# Altium schematic sheet Telephone.SchDoc (part 1 of 3)
size A1; SheetNumber: 5; SheetTotal: 11
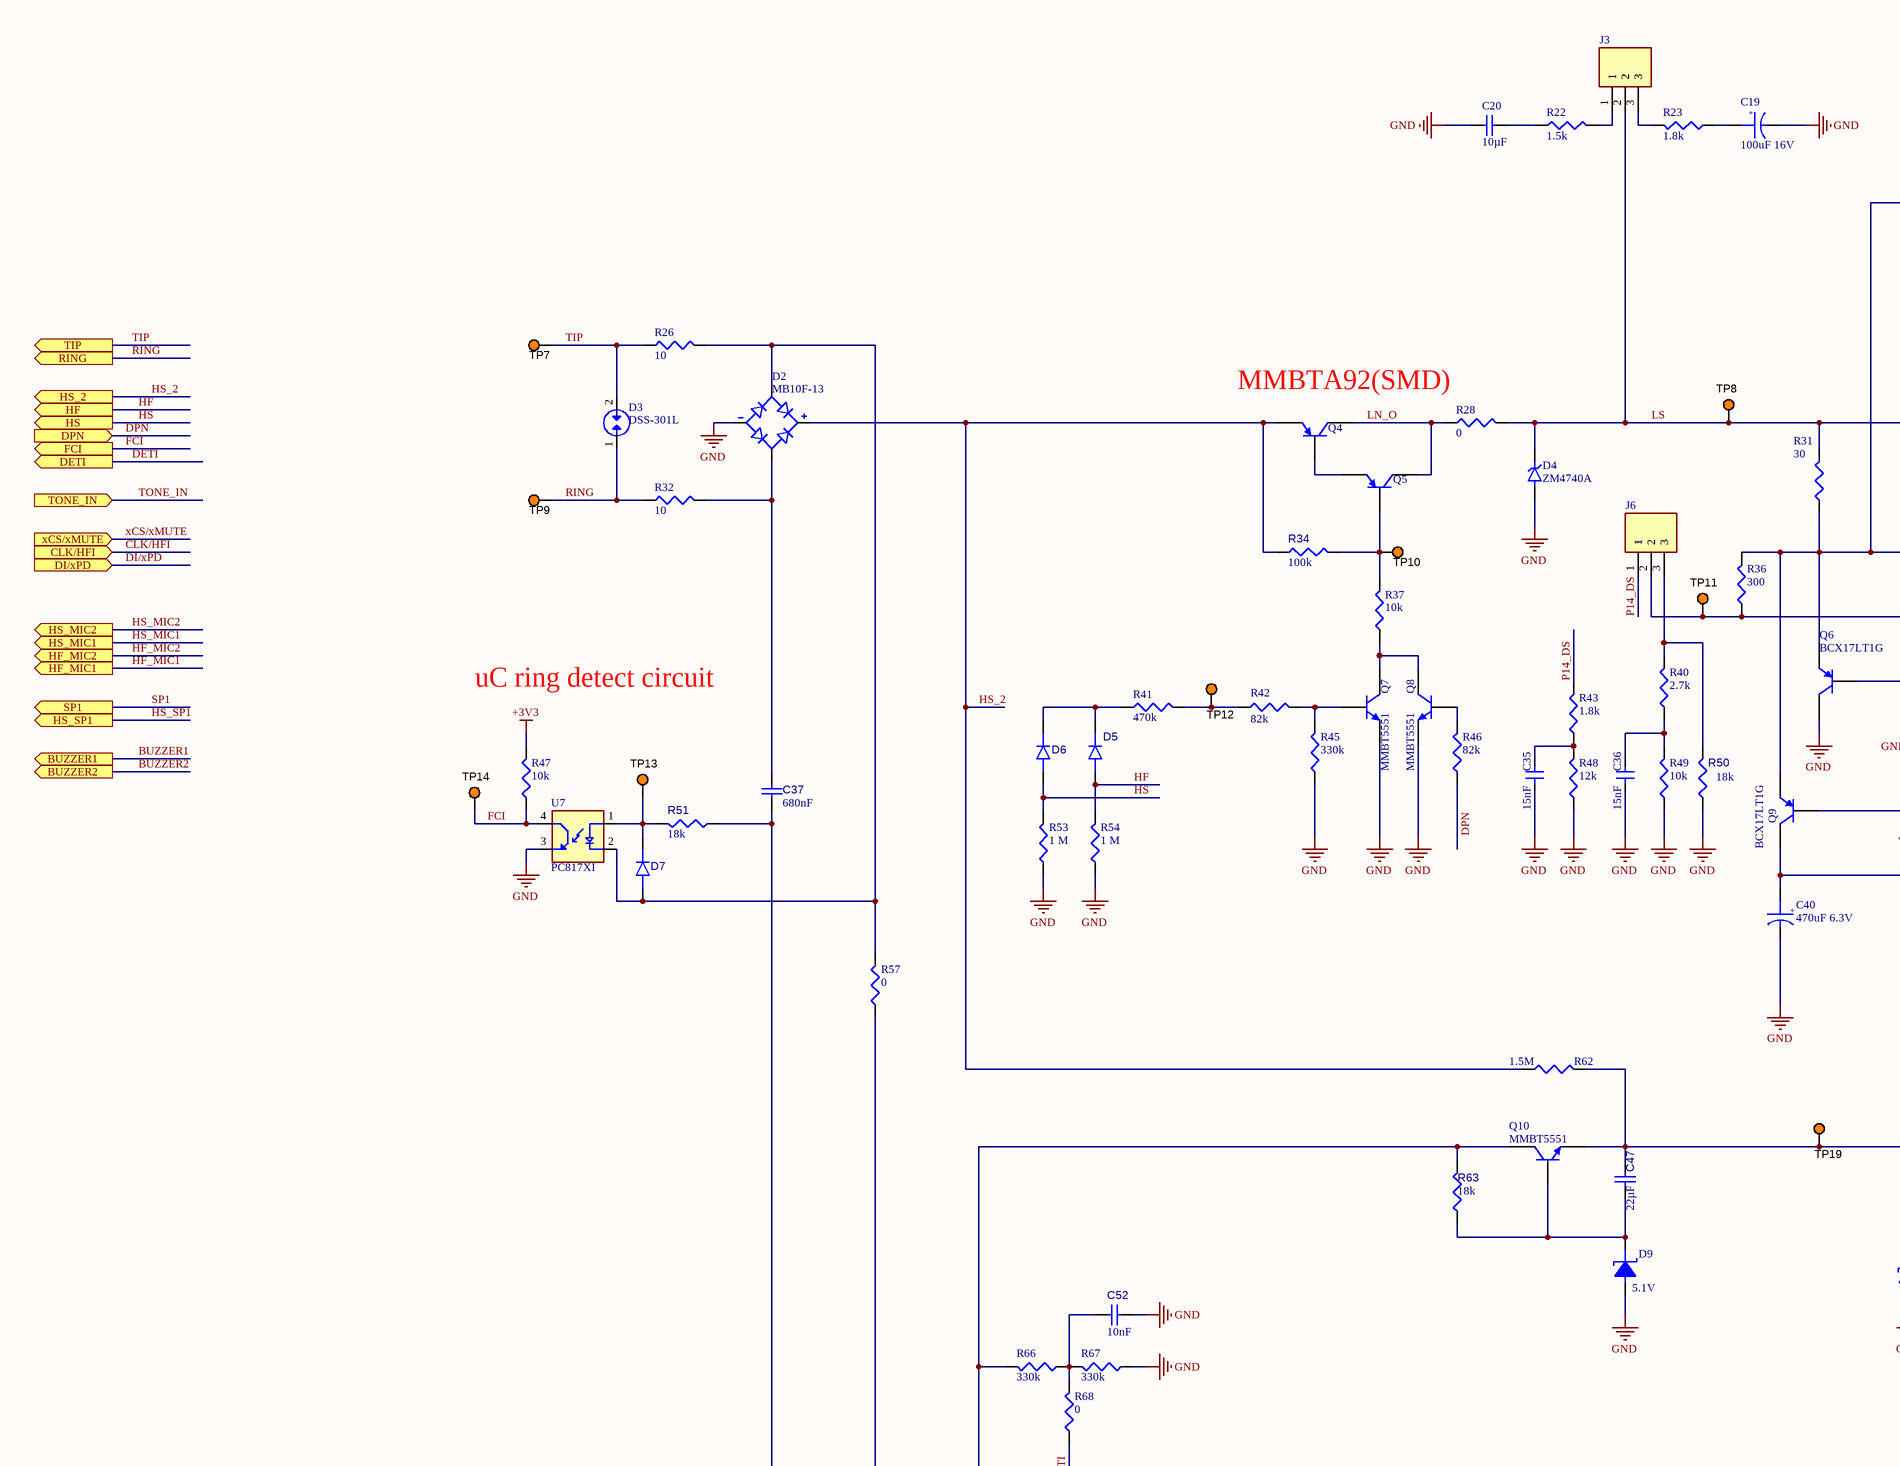
[diagram p0: Telephone.SchDoc, top left]
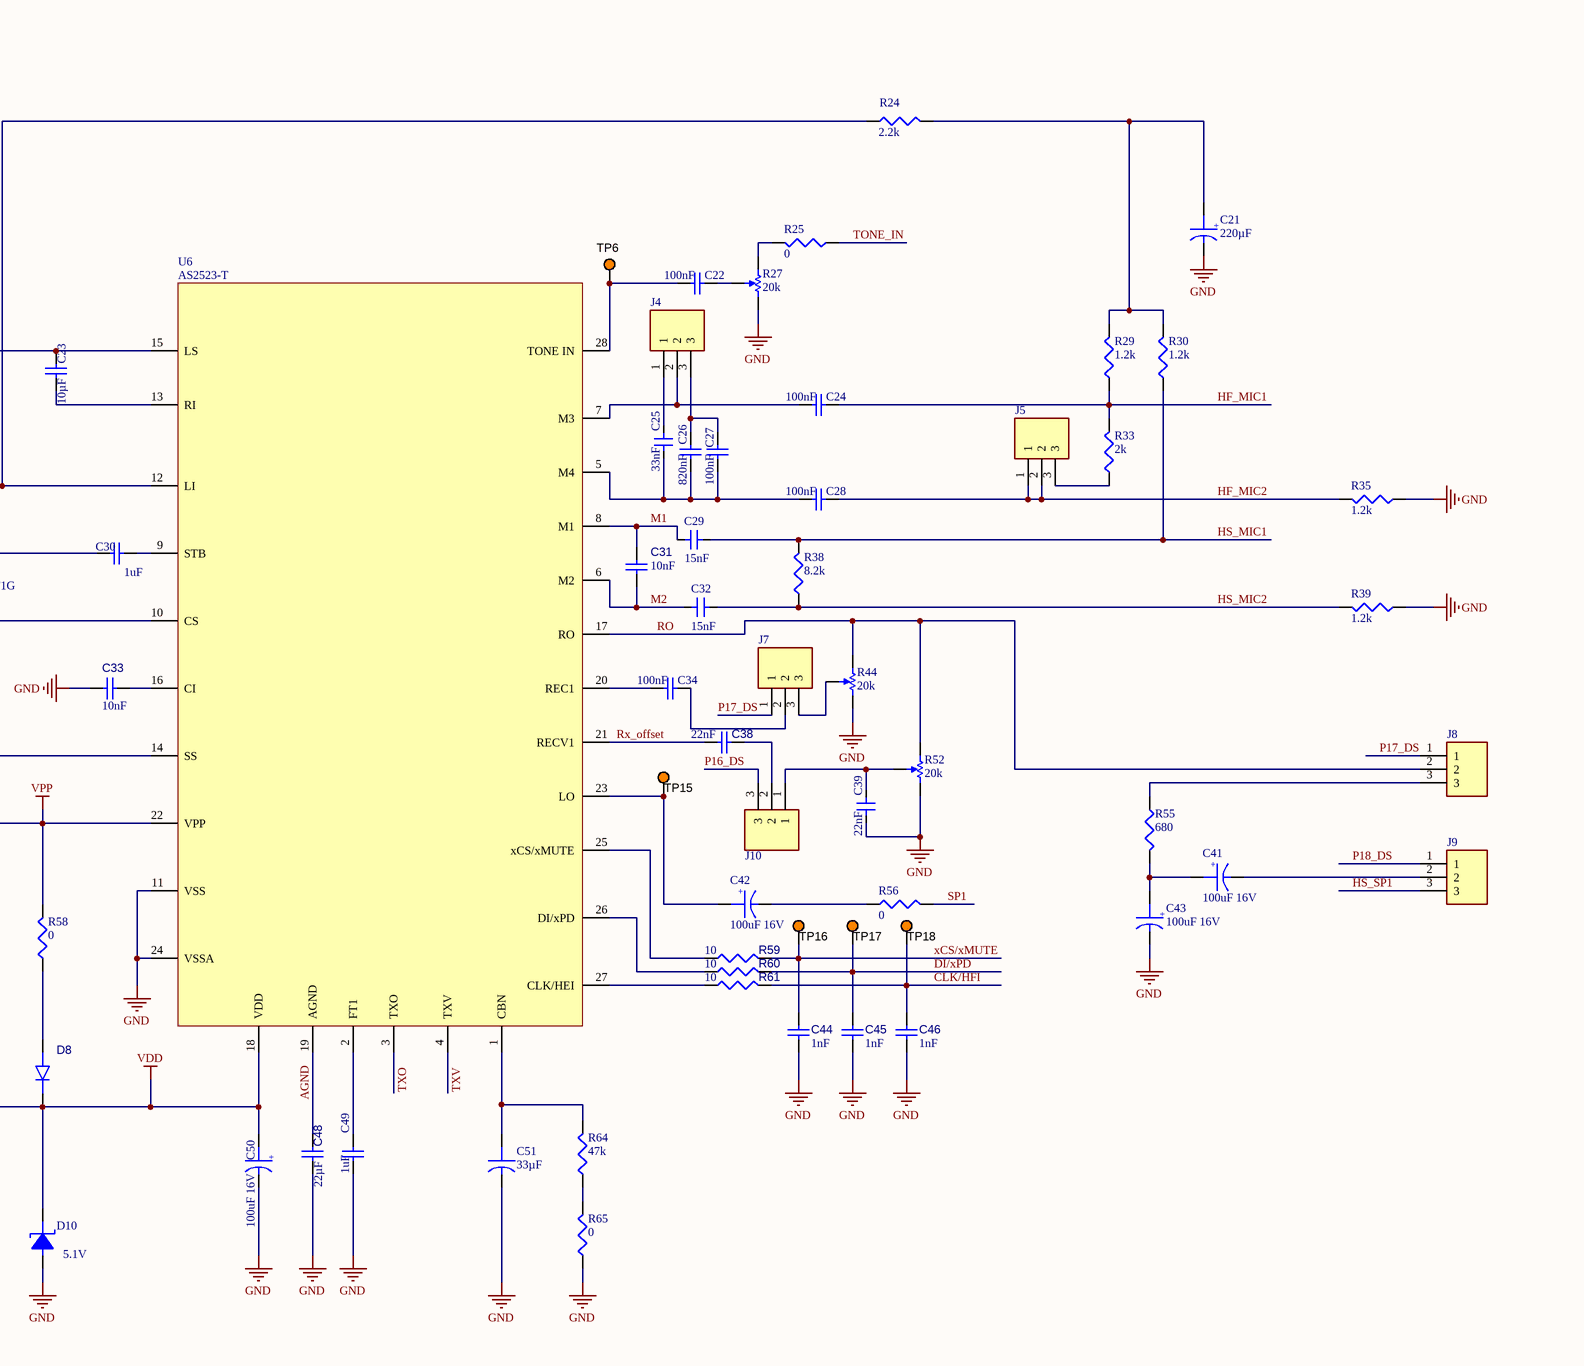
[diagram p1: Telephone.SchDoc, top right]
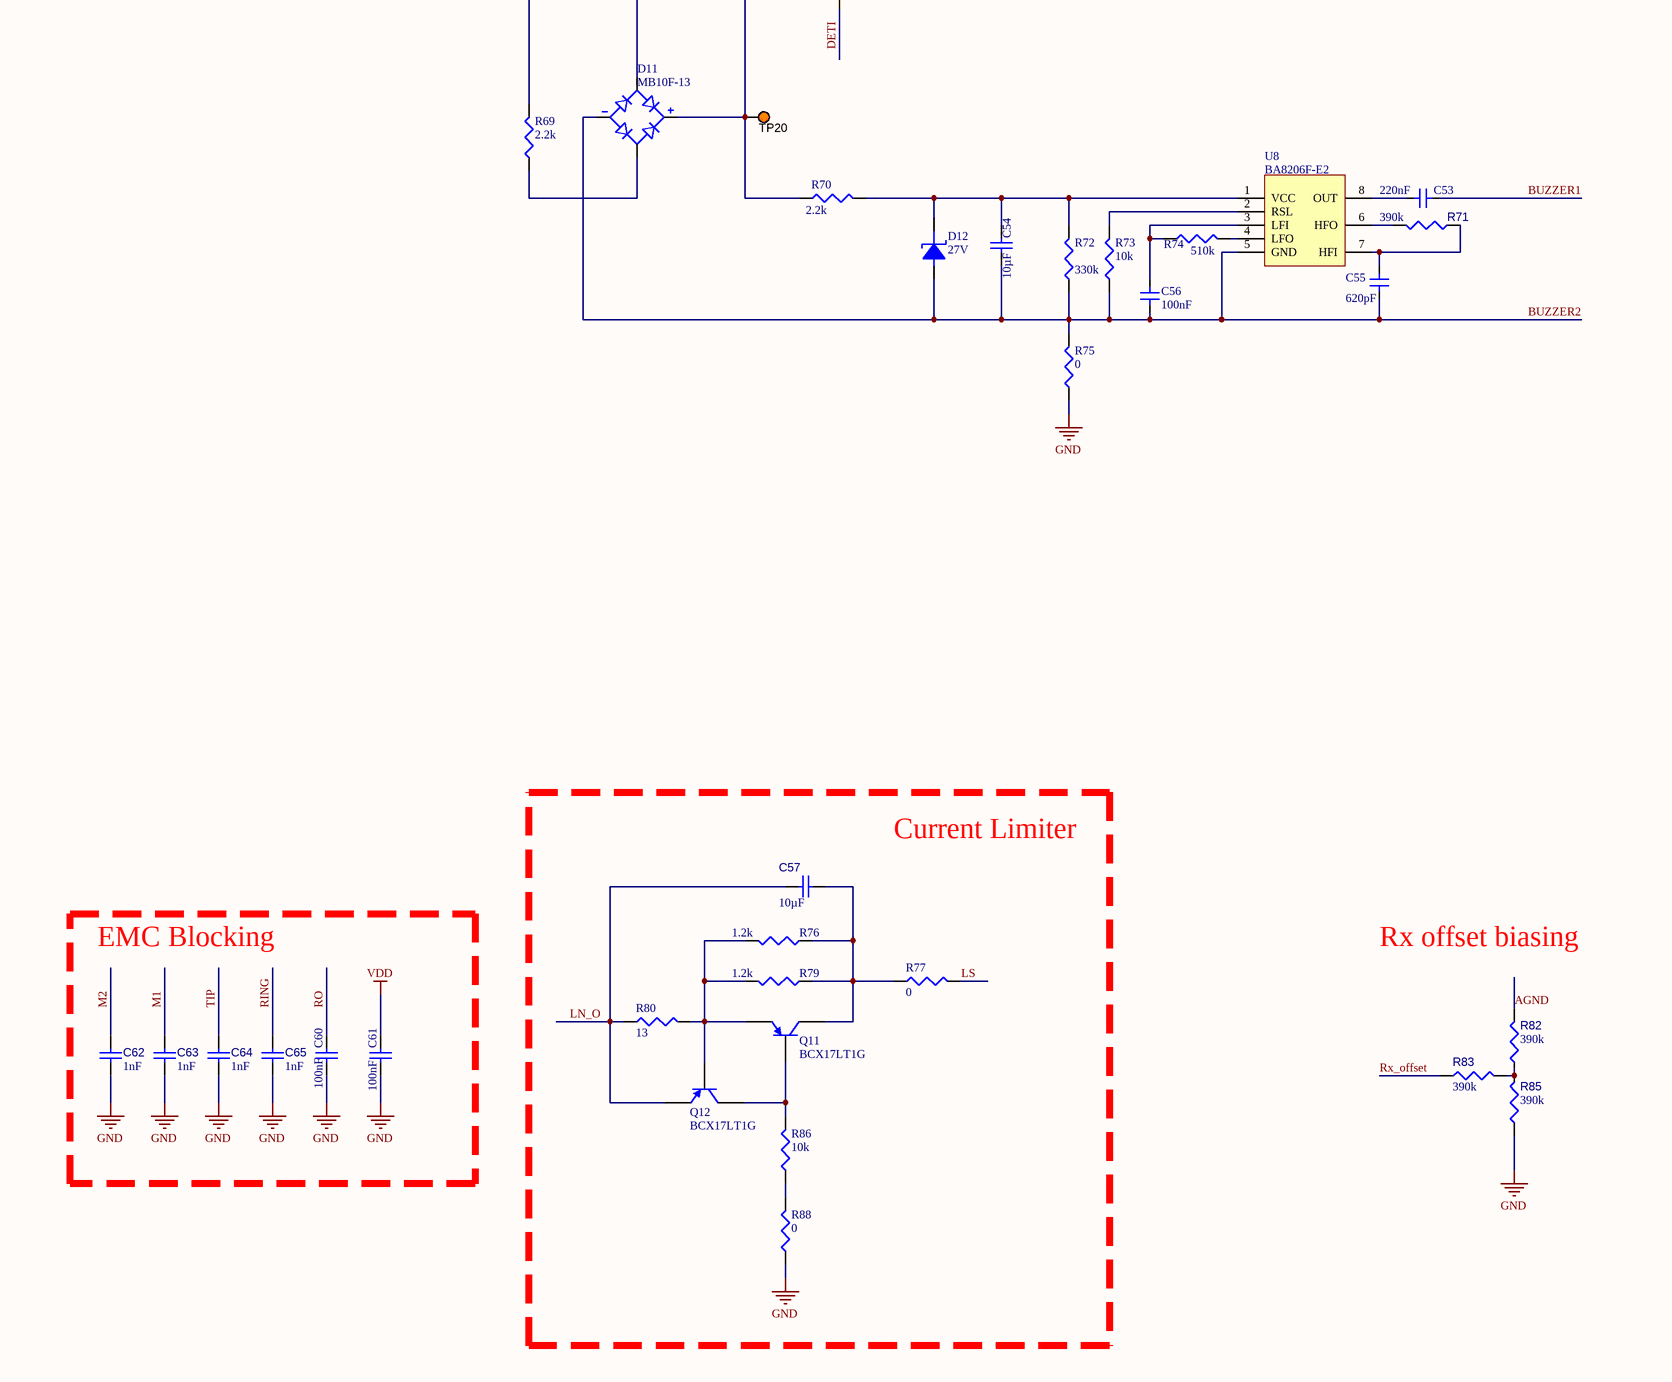
[diagram p2: Telephone.SchDoc, bottom left]
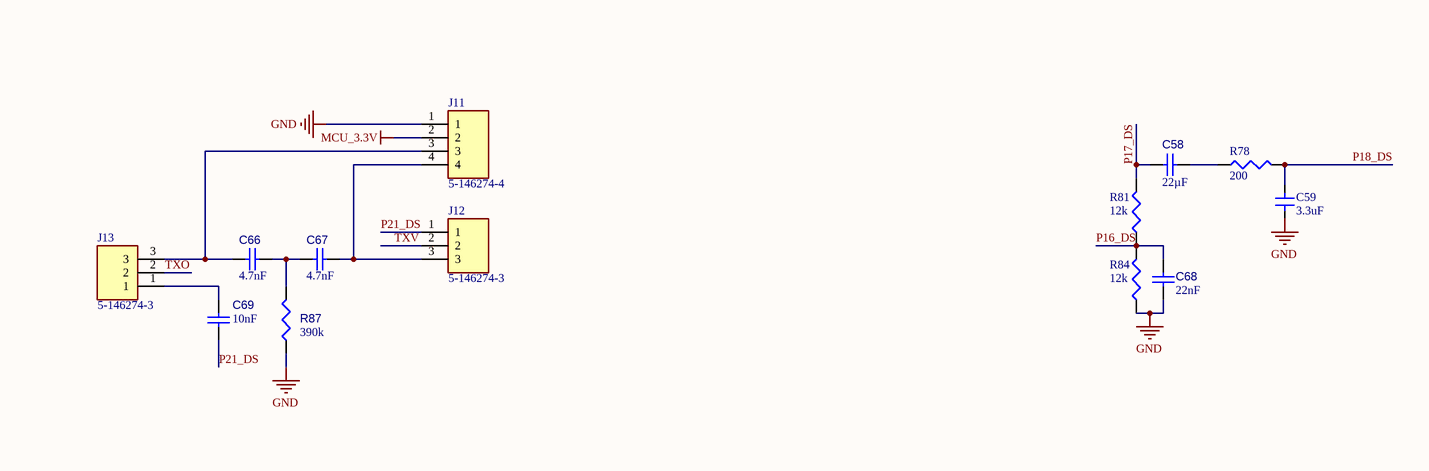
[diagram p3: Telephone.SchDoc, bottom right]

## Parts
C19  value 100uF 16V  [CAPAE6767X56M 100UF 16V]  (hidden comment: CMP-001-00187-1)
C20  value 10µF  [C1210]  (hidden comment: GRM32ER7YA106KA12L)
C21  value 220µF  [CAPAE9290X56M 220UF 6.3V]  (hidden comment: CMP-001-00174-1)
C22  value 100nF  [C0603]  (hidden comment: CC0603KRX7R8BB104)
C23  value 10µF  [C1210]  (hidden comment: GRM32ER7YA106KA12L)
C24  value 100nF  [C0603]  (hidden comment: CC0603KRX7R8BB104)
C25  value 33nF  [0805]  (hidden comment: CMP-001-00170-1)
C26  value 820nF  [C0603]  (hidden comment: CC0603KRX7R7BB824)
C27  value 100nF  [C0603]  (hidden comment: CC0603KRX7R8BB104)
C28  value 100nF  [C0603]  (hidden comment: CC0603KRX7R8BB104)
C29  value 15nF  [0805]  (hidden comment: CMP-001-00169-1)
C30  value 1uF  [C0603]  (hidden comment: CL10A105KA8NNNC)
C31  value 10nF  [C0603]  (hidden comment: 06035C103KAT2A)
C32  value 15nF  [0805]  (hidden comment: CMP-001-00169-1)
C33  value 10nF  [C0603]  (hidden comment: 06035C103KAT2A)
C34  value 100nF  [C0603]  (hidden comment: CC0603KRX7R8BB104)
C35  value 15nF  [0805]  (hidden comment: CMP-001-00169-1)
C36  value 15nF  [0805]  (hidden comment: CMP-001-00169-1)
C37  value 680nF  [C1812]  (hidden comment: 1812B684M251CT)
C38  value 22nF  [C0603]  (hidden comment: VJ0603Y223JXAAC)
C39  value 22nF  [0805]  (hidden comment: CMP-001-00184-1)
C40  value 470uF 6.3V  [CAPAE9984X105M 470UF 6.3V]  (hidden comment: CMP-001-00185-1)
C41  value 100uF 16V  [CAPAE6767X56M 100UF 16V]  (hidden comment: CMP-001-00187-1)
C42  value 100uF 16V  [CAPAE6767X56M 100UF 16V]  (hidden comment: CMP-001-00187-1)
C43  value 100uF 16V  [CAPAE6767X56M 100UF 16V]  (hidden comment: CMP-001-00187-1)
C44  value 1nF  [0603]  (hidden comment: 885342206003)
C45  value 1nF  [0603]  (hidden comment: 885342206003)
C46  value 1nF  [0603]  (hidden comment: 885342206003)
C47  value 22µF  [C0805]  (hidden comment: CL21A226KPCLRNC)
C48  value 22µF  [C0805]  (hidden comment: CL21A226KPCLRNC)
C49  value 1uF  [C0603]  (hidden comment: CL10A105KA8NNNC)
C50  value 100uF 16V  [CAPAE6767X56M 100UF 16V]  (hidden comment: CMP-001-00187-1)
C51  value 33µF  [CAPAE6342X55M 22UF 6.3V]  (hidden comment: CMP-001-00173-1)
C52  value 10nF  [C0603]  (hidden comment: 06035C103KAT2A)
C53  value 220nF  [0805]  (hidden comment: CMP-001-00181-1)
C54  value 10µF  [C1210]  (hidden comment: GRM32ER7YA106KA12L)
C55  value 620pF  [0805]  (hidden comment: CMP-001-00182-1)
C56  value 100nF  [0805]  (hidden comment: CMP-001-00168-1)
C57  value 10µF  [C1210]  (hidden comment: C1210C106M5RACTU)
C58  value 22µF  [C0805]  (hidden comment: CL21A226KPCLRNC)
C59  value 3.3uF  [0603]  (hidden comment: CMP-001-00165-1)
C60  value 100nF  [C0603]  (hidden comment: CC0603KRX7R8BB104)
C61  value 100nF  [C0603]  (hidden comment: CC0603KRX7R8BB104)
C62  value 1nF  [0603]  (hidden comment: 885342206003)
C63  value 1nF  [0603]  (hidden comment: 885342206003)
C64  value 1nF  [0603]  (hidden comment: 885342206003)
C65  value 1nF  [0603]  (hidden comment: 885342206003)
C66  value 4.7nF  [C0805]  (hidden comment: CMP-001-00190-1)
C67  value 4.7nF  [C0805]  (hidden comment: CMP-001-00190-1)
C68  value 22nF  [C0603]  (hidden comment: VJ0603Y223JXAAC)
C69  value 10nF  [C0603]  (hidden comment: 06035C103KAT2A)
D2  MB10F-13  [DIOB_MB10F-13]
D3  DSS-301L  [DSS]
D4  ZM4740A  [DIOMELF5124N]
D5  MURS140-E3/5BT  [DO-214AA-2]  (value not drawn)
D6  MURS140-E3/5BT  [DO-214AA-2]  (value not drawn)
D7  1N4148W_R1_00001  [SOD-123]  (value not drawn)
D8  1N4148W_R1_00001  [SOD-123]  (value not drawn)
D9  value 5.1V  [Zener 5.1V]  (hidden comment: DDZ5V1BS-7)
D10  value 5.1V  [Zener 5.1V]  (hidden comment: DDZ5V1BS-7)
D11  MB10F-13  [DIOB_MB10F-13]
D12  value 27V  [Diode - 27V]  (hidden comment: CMP-004-00064-1)
J3  5-146274-3  [TE_5-146274-3]  (value not drawn)
J4  5-146274-3  [TE_5-146274-3]  (value not drawn)
J5  5-146274-3  [TE_5-146274-3]  (value not drawn)
J6  5-146274-3  [TE_5-146274-3]  (value not drawn)
J7  5-146274-3  [TE_5-146274-3]  (value not drawn)
J8  5-146274-3  [TE_5-146274-3]  (value not drawn)
J9  5-146274-3  [TE_5-146274-3]  (value not drawn)
J10  5-146274-3  [TE_5-146274-3]  (value not drawn)
J11  5-146274-4  [5-146274-3]
J12  5-146274-3  [TE_5-146274-3]
J13  5-146274-3  [TE_5-146274-3]
Q4  MPSA92PBFREE  [UNIC-TO-92-3]  (value not drawn)
Q5  MPSA92PBFREE  [UNIC-TO-92-3]  (value not drawn)
Q6  BCX17LT1G  [FAIR-SOT23-3_V]
Q7  MMBT5551  [SOT23127P600-8N]
Q8  MMBT5551  [SOT23127P600-8N]
Q9  BCX17LT1G  [FAIR-SOT23-3_V]
Q10  MMBT5551  [SOT23127P600-8N]
Q11  BCX17LT1G  [FAIR-SOT23-3_V]
Q12  BCX17LT1G  [FAIR-SOT23-3_V]
R22  value 1.5k  [0805]  (hidden comment: CMP-009-00298-1)
R23  value 1.8k  [0805]  (hidden comment: CMP-009-00299-1)
R24  value 2.2k  [0805]  (hidden comment: CMP-009-00296-1)
R25  value 0  [R0603]  (hidden comment: RMCF0603ZT0R00)
R26  value 10  [R2512]  (hidden comment: 1-2176230-4)
R27  value 20k  [BOUR-TC33X-2_V]  (hidden comment: TC33X-2-203E)
R28  value 0  [R0603]  (hidden comment: RMCF0603ZT0R00)
R29  value 1.2k  [0805]  (hidden comment: CMP-009-00289-1)
R30  value 1.2k  [0805]  (hidden comment: CMP-009-00289-1)
R31  value 30  [0603]  (hidden comment: CMP-009-00303-1)
R32  value 10  [R2512]  (hidden comment: 1-2176230-4)
R33  value 2k  [0805]  (hidden comment: CMP-009-00295-1)
R34  value 100k  [R0805]  (hidden comment: RC0805FR-07100KL)
R35  value 1.2k  [0805]  (hidden comment: CMP-009-00289-1)
R36  value 300  [0805]  (hidden comment: CMP-009-00293-1)
R37  value 10k  [R0603]  (hidden comment: CRCW060310K0JNEA)
R38  value 8.2k  [0805]  (hidden comment: CMP-009-00302-1)
R39  value 1.2k  [0805]  (hidden comment: CMP-009-00289-1)
R40  value 2.7k  [0805]  (hidden comment: CMP-009-00292-1)
R41  value 470k  [0805]  (hidden comment: CMP-009-00316-1)
R42  value 82k  [0805]  (hidden comment: CMP-009-00311-1)
R43  value 1.8k  [0805]  (hidden comment: CMP-009-00299-1)
R44  value 20k  [BOUR-TC33X-2_V]  (hidden comment: TC33X-2-203E)
R45  value 330k  [0805]  (hidden comment: CMP-009-00308-1)
R46  value 82k  [0805]  (hidden comment: CMP-009-00311-1)
R47  value 10k  [R0603]  (hidden comment: CRCW060310K0JNEA)
R48  value 12k  [0805]  (hidden comment: CMP-009-00306-1)
R49  value 10k  [R0603]  (hidden comment: CRCW060310K0JNEA)
R50  value 18k  [R0805]  (hidden comment: CMP-009-00321-1)
R51  value 18k  [R0805]  (hidden comment: CMP-009-00321-1)
R52  value 20k  [BOUR-TC33X-2_V]  (hidden comment: TC33X-2-203E)
R53  value 1 M  [0805]  (hidden comment: CMP-009-00300-1)
R54  value 1 M  [0805]  (hidden comment: CMP-009-00300-1)
R55  value 680  [R0805]  (hidden comment: CRCW0805680RJNEBC)
R56  value 0  [R0603]  (hidden comment: RMCF0603ZT0R00)
R57  value 0  [0805]  (hidden comment: CMP-009-00305-1)
R58  value 0  [R0603]  (hidden comment: RMCF0603ZT0R00)
R59  value 10  [R0603]  (hidden comment: CRCW060310R0FKEAHP)
R60  value 10  [R0603]  (hidden comment: CRCW060310R0FKEAHP)
R61  value 10  [R0603]  (hidden comment: CRCW060310R0FKEAHP)
R62  value 1.5M  [0805]  (hidden comment: CMP-009-00294-1)
R63  value 18k  [R0805]  (hidden comment: CMP-009-00321-1)
R64  value 47k  [0805]  (hidden comment: CMP-009-00314-1)
R65  value 0  [R0603]  (hidden comment: RMCF0603ZT0R00)
R66  value 330k  [0805]  (hidden comment: CMP-009-00308-1)
R67  value 330k  [0805]  (hidden comment: CMP-009-00308-1)
R68  value 0  [R0603]  (hidden comment: RMCF0603ZT0R00)
R69  value 2.2k  [0805]  (hidden comment: CMP-009-00315-1)
R70  value 2.2k  [0805]  (hidden comment: CMP-009-00296-1)
R71  value 390k  [R0805]  (hidden comment: CMP-009-00320-1)
R72  value 330k  [0805]  (hidden comment: CMP-009-00308-1)
R73  value 10k  [R0603]  (hidden comment: CRCW060310K0JNEA)
R74  value 510k  [0805]  (hidden comment: CMP-009-00309-1)
R75  value 0  [R0603]  (hidden comment: RMCF0603ZT0R00)
R76  value 1.2k  [0805]  (hidden comment: CMP-009-00289-1)
R77  value 0  [R0603]  (hidden comment: RMCF0603ZT0R00)
R78  value 200  [0805]  (hidden comment: CMP-009-00291-1)
R79  value 1.2k  [0805]  (hidden comment: CMP-009-00289-1)
R80  value 13  [0805]  (hidden comment: CMP-009-00290-1)
R81  value 12k  [0805]  (hidden comment: CMP-009-00306-1)
R82  value 390k  [R0805]  (hidden comment: CMP-009-00320-1)
R83  value 390k  [R0805]  (hidden comment: CMP-009-00320-1)
R84  value 12k  [0805]  (hidden comment: CMP-009-00306-1)
R85  value 390k  [R0805]  (hidden comment: CMP-009-00320-1)
R86  value 10k  [R0603]  (hidden comment: CRCW060310K0JNEA)
R87  value 390k  [R0805]  (hidden comment: CMP-009-00320-1)
R88  value 0  [R0603]  (hidden comment: RMCF0603ZT0R00)
TP6  5003  [KSTN-5003]  (value not drawn)
TP7  5003  [KSTN-5003]  (value not drawn)
TP8  5003  [KSTN-5003]  (value not drawn)
TP9  5003  [KSTN-5003]  (value not drawn)
TP10  5003  [KSTN-5003]  (value not drawn)
TP11  5003  [KSTN-5003]  (value not drawn)
TP12  5003  [KSTN-5003]  (value not drawn)
TP13  5003  [KSTN-5003]  (value not drawn)
TP14  5003  [KSTN-5003]  (value not drawn)
TP15  5003  [KSTN-5003]  (value not drawn)
TP16  5003  [KSTN-5003]  (value not drawn)
TP17  5003  [KSTN-5003]  (value not drawn)
TP18  5003  [KSTN-5003]  (value not drawn)
TP19  5003  [KSTN-5003]  (value not drawn)
TP20  5003  [KSTN-5003]  (value not drawn)
U6  AS2523-T  [AS2523]
U7  PC817XI  [SOIC254P975X460-4N]
U8  BA8206F-E2  [BA8206]

## Blocks framed on the sheet
Current Limiter: C57 Q11 Q12 R76 R77 R79 R80 R86 R88
EMC Blocking: C60-C65

## Ports
BUZZER1 (out), BUZZER2 (out), CLK/HFI (in), DETI (out), DI/xPD (in), DPN (in), FCI (out), HF (out), HF_MIC1 (out), HF_MIC2 (out), HS (out), HS_2 (out), HS_MIC1 (out), HS_MIC2 (out), HS_SP1 (out), RING (out), SP1 (out), TIP (out), TONE_IN (in), xCS/xMUTE (in)

## Nets
+3V3: R47.2
GND: C19.2 C20.2 C21.2 C33.1 C35.1 C36.1 C39.1 C40.2 C43.2 C44.1 C45.1 C46.1 C48.1 C49.1 C50.2 C51.2 C52.1 C59.2 C60.1 C61.1 C62.1 C63.1 C64.1 C65.1 C68.1 D2.3(NEG) D4.A D9.2 D10.2 J11.1 Q6.3(C) Q7.1(E) Q8.1(E) R27.3 R35.1 R39.1 R44.3 R45.1 R48.1 R49.1 R50.1 R52.3 R53.1 R54.1 R65.1 R67.1 R75.1 R84.1 R85.1 R87.1 R88.1 U6.11(VSS) U6.24(VSSA) U7.3(ET)
MCU_3.3V: J11.2
VDD: C47.2 C50.1 C61.2 D8.1(K) D10.1 Q10.1(E) R62.2 TP19.1 U6.18(VDD)
VPP: C40.1 Q9.3(C) R58.2 U6.22(VPP)
AGND: C48.2 R82.2 U6.19(AGND)
BUZZER1: C53.2 ; port BUZZER1
BUZZER2: C54.1 C55.1 C56.2 D11.3(NEG) D12.2 R72.1 R73.1 R75.2 U8.5(GND) ; port BUZZER2
CLK/HFI: C46.2 R61.2 TP18.1 ; port CLK/HFI
DETI: R68.1 ; port DETI
DI/xPD: C45.2 R60.2 TP17.1 ; port DI/xPD
DPN: R46.1 ; port DPN
FCI: R47.1 TP14.1 U7.4(CT) ; port FCI
HF: D5.2(A) R54.2 ; port HF
HF_MIC1: C24.2 R29.1 R33.2 ; port HF_MIC1
HF_MIC2: C28.1 J5.1 J5.2 R35.2 ; port HF_MIC2
HS: D6.2(A) R53.2 ; port HS
HS_2: D2.1(POS) Q4.1(E) R34.1 R62.1 ; port HS_2
HS_MIC1: C29.2 R30.1 R38.2 ; port HS_MIC1
HS_MIC2: C32.2 R38.1 R39.2 ; port HS_MIC2
HS_SP1: J9.3 ; port HS_SP1
LN_O: C57.1 Q4.3(C) Q5.3(C) Q12.2(E) R28.1 R80.1
LS: C23.2 D4.C(K) J3.2 R28.2 R31.2 R77.2 TP8.1 U6.15(LS)
M1: C29.1 C31.2 C63.2 U6.8(M1)
M2: C31.1 C32.1 C62.2 U6.6(M2)
P14_DS: J6.1 R43.2
P16_DS: C68.2 J10.3 R81.1 R84.2
P17_DS: C58.2 J7.1 J8.1 R81.2
P18_DS: C59.1 J9.1 R78.2
P21_DS: C69.1 J12.1
RING: C65.2 D3.1 R32.1 TP9.1 ; port RING
RO: C60.2 J8.2 R44.1 R52.1 U6.17(RO)
Rx_offset: C38.1 R83.1 U6.21(RECV1)
SP1: R56.2 ; port SP1
TIP: C64.2 D3.2 R26.1 TP7.1 ; port TIP
TONE_IN: R25.1 ; port TONE_IN
TXO: J13.2 U6.3(TXO)
TXV: J12.2 U6.4(TXV)
xCS/xMUTE: C44.2 R59.2 TP16.1 ; port xCS/xMUTE
NetC19_1: C19.1 R23.1
NetC20_1: C20.1 R22.1
NetC21_1: C21.1 R24.2 R29.2 R30.2
NetC22_1: C22.1 TP6.1 U6.28(TONE_IN)
NetC22_2: C22.2 R27.2
NetC23_1: C23.1 U6.13(RI)
NetC24_1: C24.1 J4.2 U6.7(M3)
NetC25_1: C25.1 C26.1 C27.1 C28.2 U6.5(M4)
NetC25_2: C25.2 J4.1
NetC26_2: C26.2 C27.2 J4.3
NetC30_1: C30.1 U6.9(STB)
NetC30_2: C30.2 J6.2 R36.1 TP11.1
NetC33_2: C33.2 U6.16(CI)
NetC34_1: C34.1 U6.20(REC1)
NetC34_2: C34.2 J7.2
NetC35_2: C35.2 R43.1 R48.2
NetC36_2: C36.2 R40.1 R49.2
NetC37_1: C37.1 R51.1 R69.2
NetC37_2: C37.2 D2.4(AC2) R32.2
NetC38_2: C38.2 J10.2
NetC39_2: C39.2 J10.1 R52.2
NetC41_1: C41.1 C43.1 R55.2
NetC41_2: C41.2 J9.2
NetC42_1: C42.1 TP15.1 U6.23(LO)
NetC42_2: C42.2 R56.1
NetC47_1: C47.1 D9.1 Q10.2(B) R63.1
NetC49_2: C49.2 U6.2(FT1)
NetC51_1: C51.1 R64.2 U6.1(CBN)
NetC52_2: C52.2 R66.1 R67.2 R68.2
NetC53_1: C53.1 U8.8(OUT)
NetC54_2: C54.2 D12.1 R70.2 R72.2 U8.1(VCC)
NetC55_2: C55.2 R71.1 U8.7(HFI)
NetC56_1: C56.1 R74.1 U8.3(LFI)
NetC57_2: C57.2 Q11.3(C) R76.1 R77.1 R79.1
NetC58_1: C58.1 R78.1
NetC66_1: C66.1 J11.3 J13.3
NetC66_2: C66.2 C67.1 R87.2
NetC67_2: C67.2 J11.4 J12.3
NetC69_2: C69.2 J13.1
NetD2_2: D2.2(AC1) D7.2(A) R26.2 R57.2 U7.2(C)
NetD5_1: D5.1(K) D6.1(K) R41.1
NetD7_1: D7.1(K) R51.2 TP13.1 U7.1(A)
NetD8_2: D8.2(A) R58.1
NetD11_1: D11.1(POS) Q10.3(C) R63.2 R66.2 R70.1 TP20.1
NetD11_2: D11.2(AC1) R57.1
NetD11_4: D11.4(AC2) R69.1
NetJ3_1: J3.1 R22.2
NetJ3_3: J3.3 R23.2
NetJ5_3: J5.3 R33.1
NetJ6_3: J6.3 R40.2 R50.2
NetJ7_3: J7.3 R44.2
NetJ8_3: J8.3 R55.1
NetQ4_2: Q4.2(B) Q5.1(E)
NetQ5_2: Q5.2(B) R34.2 R37.2 TP10.1
NetQ6_1: Q6.1(B) U6.10(CS)
NetQ6_2: Q6.2(E) Q9.2(E) R24.1 R31.1 R36.2 U6.12(LI)
NetQ7_2: Q7.2(B) R42.2 R45.2
NetQ7_3: Q7.3(C) Q8.3(C) R37.1
NetQ8_2: Q8.2(B) R46.2
NetQ9_1: Q9.1(B) U6.14(SS)
NetQ11_1: Q11.1(B) Q12.3(C) R86.2
NetQ11_2: Q11.2(E) Q12.1(B) R76.2 R79.2 R80.2
NetR25_2: R25.2 R27.1
NetR41_2: R41.2 R42.1 TP12.1
NetR59_1: R59.1 U6.25(xCS/xMUTE)
NetR60_1: R60.1 U6.26(DI/xPD)
NetR61_1: R61.1 U6.27(CLK/HEI)
NetR64_1: R64.1 R65.2
NetR71_2: R71.2 U8.6(HFO)
NetR73_2: R73.2 U8.2(RSL)
NetR74_2: R74.2 U8.4(LFO)
NetR82_1: R82.1 R83.2 R85.2
NetR86_1: R86.1 R88.2

## Notes on the sheet
- (near Q4) MMBTA92(SMD)
- uC ring detect circuit
- Rx offset biasing
- Title:
- Page Contents:
- Drawn By:
- Size:
- A2
- DWG:
- Revision:
- Checked By:
- Date:
- Email:
- Time:
- Sheet
- of
- Website:
- (in symbol CMP-001-00174-1) +
- (in symbol CMP-001-00185-1) +
- (in symbol CMP-001-00187-1) +